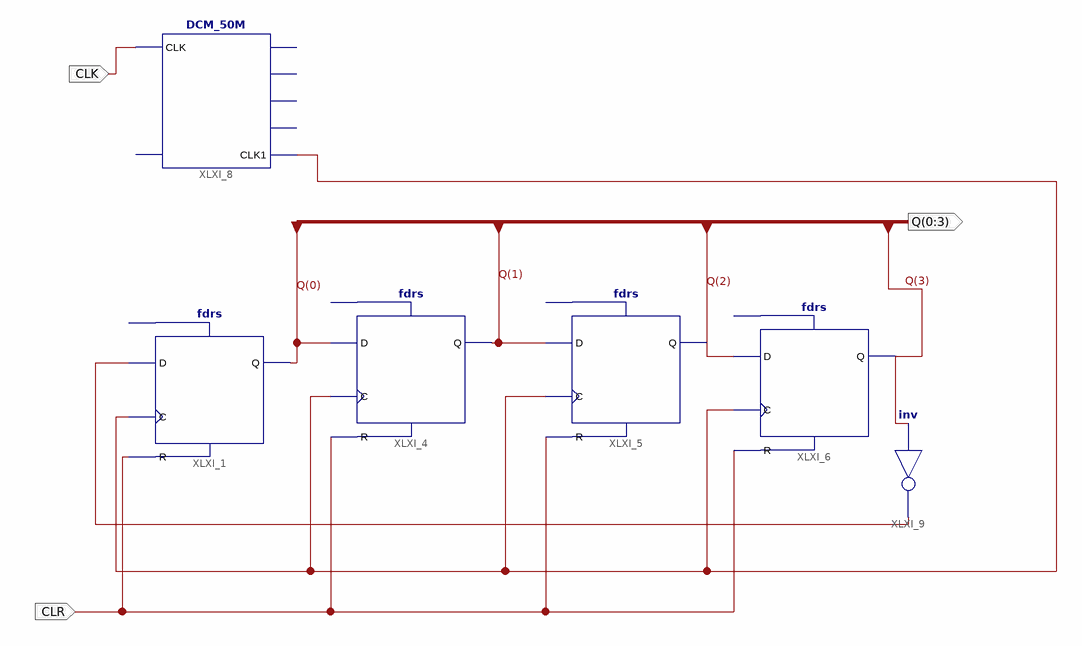
[diagram p0: schematic sheet 1]
// Xilinx ISE schematic Lab7exp8.sch (spartan3e) as structural Verilog: 6 symbols, 3 ports
module Lab7exp8 (
  input  CLK,
  input  CLR,
  output [0:3] Q
);

  wire XLXN_33, XLXN_47;

  fdrs XLXI_1 (.C(XLXN_33), .D(XLXN_47), .R(CLR), .Q(Q[0]));  // open: S
  fdrs XLXI_4 (.C(XLXN_33), .D(Q[0]), .R(CLR), .Q(Q[1]));  // open: S
  fdrs XLXI_5 (.C(XLXN_33), .D(Q[1]), .R(CLR), .Q(Q[2]));  // open: S
  fdrs XLXI_6 (.C(XLXN_33), .D(Q[2]), .R(CLR), .Q(Q[3]));  // open: S
  DCM_50M XLXI_8 (.CLK(CLK), .CLK1(XLXN_33));  // open: RST, CLK1M, CLK10k, CLK1k, CLK100
  not XLXI_9 (XLXN_47, Q[3]);
endmodule
